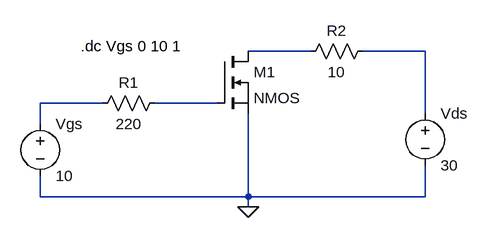
[diagram p0: schematic Shubham Rattra _ UE185112 _ exp3.asc]
Shubham Rattra _ UE185112 _ exp3.asc, the LTspice schematic file:
Version 4
SHEET 1 880 680
WIRE 352 64 256 64
WIRE 528 64 432 64
WIRE 32 144 -64 144
WIRE 208 144 112 144
WIRE 528 160 528 64
WIRE -64 176 -64 144
WIRE -64 288 -64 256
WIRE 256 288 256 160
WIRE 256 288 -64 288
WIRE 528 288 528 240
WIRE 528 288 256 288
WIRE 256 304 256 288
FLAG 256 304 0
SYMBOL nmos 208 64 R0
SYMATTR InstName M1
SYMBOL res 128 128 R90
WINDOW 0 0 56 VBottom 2
WINDOW 3 32 56 VTop 2
SYMATTR InstName R1
SYMATTR Value 220
SYMBOL res 448 48 R90
WINDOW 0 0 56 VBottom 2
WINDOW 3 32 56 VTop 2
SYMATTR InstName R2
SYMATTR Value 10
SYMBOL voltage -64 160 R0
SYMATTR InstName Vgs
SYMATTR Value 10
SYMBOL voltage 528 144 R0
SYMATTR InstName Vds
SYMATTR Value 30
TEXT -2 56 Left 2 !.dc Vgs 0 10 1

The netlist it stands for:
* Shubham Rattra _ UE185112 _ exp3.asc
M1 N001 N004 0 0 NMOS
R1 N004 N003 220
R2 N002 N001 10
Vgs N003 0 10
Vds N002 0 30
.model NMOS NMOS
.model PMOS PMOS
.lib standard.mos
.dc Vgs 0 10 1
.backanno
.end